# Altium schematic sheet MKXdbV2_DAC0.SchDoc
size A
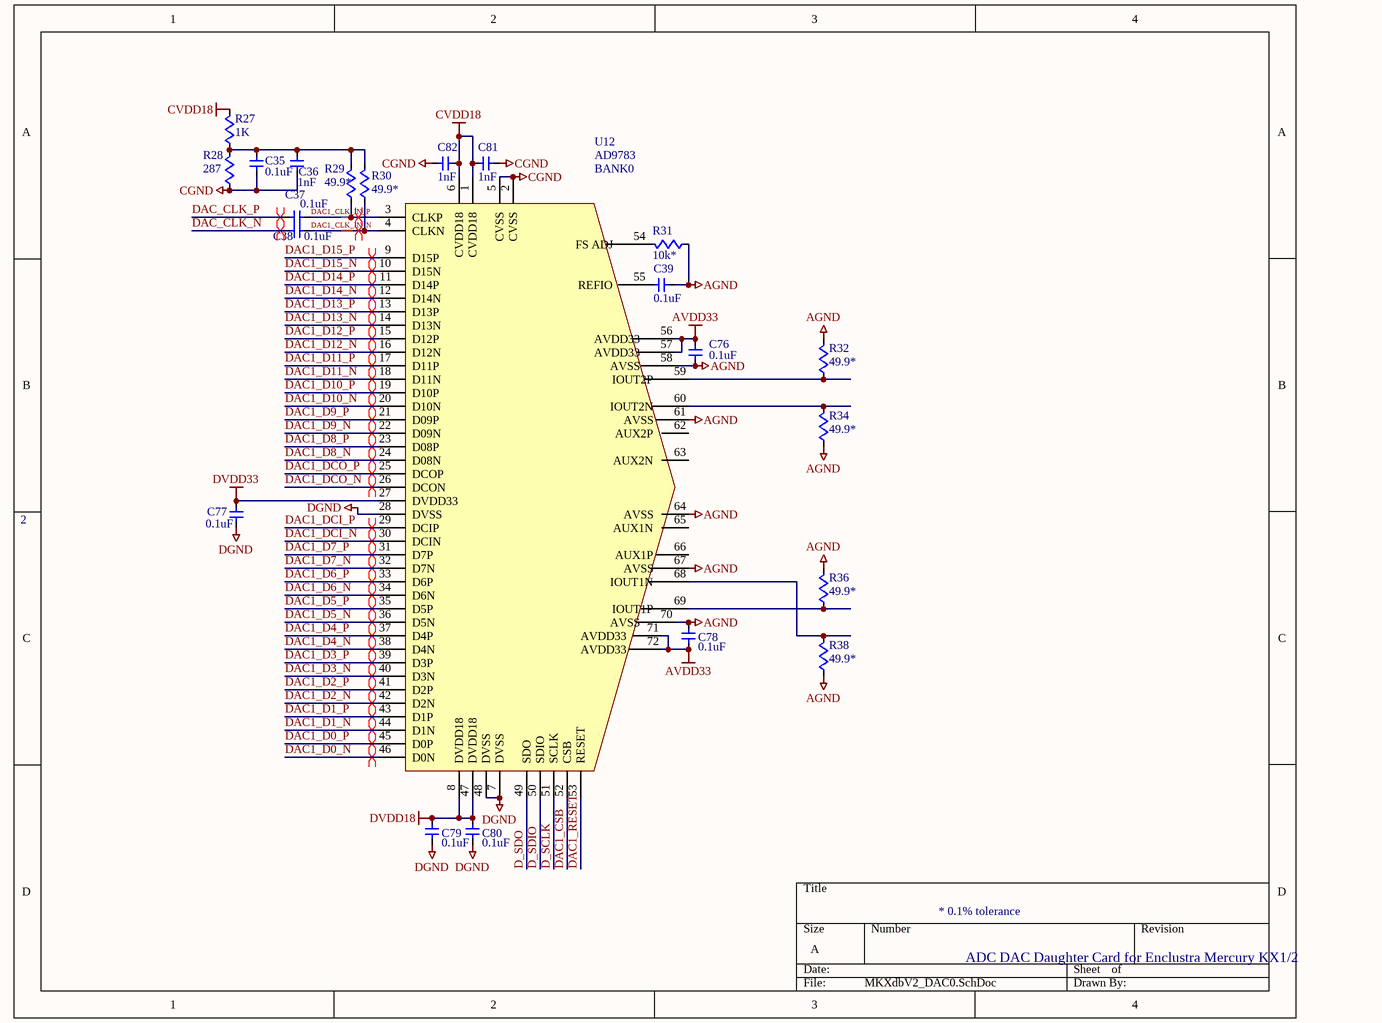
[diagram p0: MKXdbV2_DAC0.SchDoc]

## Parts
C35  0.1uF  [0603w]
C36  1nF  [0603w]
C37  0.1uF  [1206]
C38  0.1uF  [1206]
C39  0.1uF  [0603w]
C76  0.1uF  [0603w]
C77  0.1uF  [0603w]
C78  0.1uF  [0603w]
C79  0.1uF  [0603w]
C80  0.1uF  [0603w]
C81  1nF  [0603w]
C82  1nF  [0603w]
R27  1K  [0603w]
R28  287  [0603w]
R29  49.9*  [0603w]
R30  49.9*  [0603w]
R31  10k*  [0603w]
R32  49.9*  [0603w]
R34  49.9*  [0603w]
R36  49.9*  [0603w]
R38  49.9*  [0603w]
U12  AD9783  [LFCSP72]

## Nets
AGND: C39.2 C76.1 C78.2 R31.1 R32.2 R34.1 R36.2 R38.1 U12.58(AVSS) U12.61(AVSS) U12.64(AVSS) U12.67(AVSS) U12.70(AVSS)
AVDD33: C76.2 C78.1 U12.56(AVDD33) U12.57(AVDD33) U12.71(AVDD33) U12.72(AVDD33)
CGND: C35.2 C36.2 C81.2 C82.2 R28.1 U12.2(CVSS) U12.5(CVSS)
CVDD18: C81.1 C82.1 R27.2 U12.1(CVDD18) U12.6(CVDD18)
DGND: C77.2 C79.1 C80.1 U12.7(DVSS) U12.28(DVSS) U12.48(DVSS)
DVDD18: C79.2 C80.2 U12.8(DVDD18) U12.47(DVDD18)
DVDD33: C77.1 U12.27(DVDD33)
D_SCLK: U12.51(SCLK)
D_SDIO: U12.50(SDIO)
D_SDO: U12.49(SDO)
DAC1_CLK_IN_N: C38.2 R30.1 U12.4(CLKN)
DAC1_CLK_IN_P: C37.2 R29.1 U12.3(CLKP)
DAC1_CSB: U12.52(CSB)
DAC1_D0_N: U12.46(D0N)
DAC1_D0_P: U12.45(D0P)
DAC1_D1_N: U12.44(D1N)
DAC1_D1_P: U12.43(D1P)
DAC1_D2_N: U12.42(D2N)
DAC1_D2_P: U12.41(D2P)
DAC1_D3_N: U12.40(D3N)
DAC1_D3_P: U12.39(D3P)
DAC1_D4_N: U12.38(D4N)
DAC1_D4_P: U12.37(D4P)
DAC1_D5_N: U12.36(D5N)
DAC1_D5_P: U12.35(D5P)
DAC1_D6_N: U12.34(D6N)
DAC1_D6_P: U12.33(D6P)
DAC1_D7_N: U12.32(D7N)
DAC1_D7_P: U12.31(D7P)
DAC1_D8_N: U12.24(D08N)
DAC1_D8_P: U12.23(D08P)
DAC1_D9_N: U12.22(D09N)
DAC1_D9_P: U12.21(D09P)
DAC1_D10_N: U12.20(D10N)
DAC1_D10_P: U12.19(D10P)
DAC1_D11_N: U12.18(D11N)
DAC1_D11_P: U12.17(D11P)
DAC1_D12_N: U12.16(D12N)
DAC1_D12_P: U12.15(D12P)
DAC1_D13_N: U12.14(D13N)
DAC1_D13_P: U12.13(D13P)
DAC1_D14_N: U12.12(D14N)
DAC1_D14_P: U12.11(D14P)
DAC1_D15_N: U12.10(D15N)
DAC1_D15_P: U12.9(D15P)
DAC1_DCI_N: U12.30(DCIN)
DAC1_DCI_P: U12.29(DCIP)
DAC1_DCO_N: U12.26(DCON)
DAC1_DCO_P: U12.25(DCOP)
DAC1_RESET: U12.53(RESET)
DAC_CLK_N: C38.1
DAC_CLK_P: C37.1
NetC35_1: C35.1 C36.1 R27.1 R28.2 R29.2 R30.2
NetC39_1: C39.1 U12.55(REFIO)
NetR31_2: R31.2 U12.54(FS_ADJ)
NetR32_1: R32.1 U12.59(IOUT2P)
NetR34_2: R34.2 U12.60(IOUT2N)
NetR36_1: R36.1 U12.69(IOUT1P)
NetR38_2: R38.2 U12.68(IOUT1N)

Not connected (* = marked no-connect by the designer): U12 62(AUX2P) 63(AUX2N) 65(AUX1N) 66(AUX1P)

## Layout directives
differential pair: DAC1_CLK_IN_N, DAC1_CLK_IN_P, DAC1_D0_N, DAC1_D0_P, DAC1_D1_N, DAC1_D1_P, DAC1_D2_N, DAC1_D2_P, DAC1_D3_N, DAC1_D3_P, DAC1_D4_N, DAC1_D4_P, DAC1_D5_N, DAC1_D5_P, DAC1_D6_N, DAC1_D6_P, DAC1_D7_N, DAC1_D7_P, DAC1_D8_N, DAC1_D8_P, DAC1_D9_N, DAC1_D9_P, DAC1_D10_N, DAC1_D10_P, DAC1_D11_N, DAC1_D11_P, DAC1_D12_N, DAC1_D12_P, DAC1_D13_N, DAC1_D13_P, DAC1_D14_N, DAC1_D14_P, DAC1_D15_N, DAC1_D15_P, DAC1_DCI_N, DAC1_DCI_P, DAC1_DCO_N, DAC1_DCO_P, DAC_CLK_N, DAC_CLK_P

## Notes on the sheet
- (near U12) BANK0
- 2
- * 0.1% tolerance
- ADC DAC Daughter Card for Enclustra Mercury KX1/2

## Library data of the parts
C35 C39 C76-C80 = CAP_SM_1: capacitor; Manufacturer: Kemet; Manufacturer Part Number: C0603C104K3RACTU; Capacitance: 0.1µF; Temperature Coefficient: X7R; Tolerance: ±10%; Voltage - Rated: 25V; Applications: General Purpose; Category: Capacitors; ComponentLink1Description: http://www.kemet.com/datasheets&C0603C104K3RACTU; ComponentLink1URL: http://www.kemet.com/datasheets&C0603C104K3RACTU; Features: -; Lead Spacing: -; Lead Style: -; Mounting Type: Surface Mount, MLCC; Operating Temperature: -55°C ~ 125°C; Package / Case: 0603 (1608 Metric); Packaging: Cut Tape (CT); Pricing 1: 10=0.075, 100=0.027, 250=0.01952, 500=0.0144, 1000=0.00975 (USD); Ratings: -; RoHS: RoHS Compliant; Size / Dimension: 0.063" L x 0.032" W (1.60mm x 0.80mm); Stock 1: 2338960; Supplier 1: Digi-Key; Supplier Part Number 1: 399-1281-1-ND; Thickness: 0.80mm
C36 C81 C82 = CAP_SM_1: capacitor; Manufacturer: Murata Electronics North America; Manufacturer Part Number: GRM188R71H102KA01D; Capacitance: 1000pF; Voltage - Rated: 50V; Tolerance: ±10%; Temperature Coefficient: X7R; Supplier 1: Digi-Key; Supplier Part Number 1: 490-1494-1-ND; RoHS: RoHS Compliant; Category: Capacitors; Stock 1: 512721; Pricing 1: 1=0.07, 10=0.043, 50=0.0204, 100=0.0153, 250=0.01104, 500=0.00816, 1000=0.00553 (USD); Mounting Type: Surface Mount, MLCC; Operating Temperature: -55°C ~ 125°C; Applications: General Purpose; Ratings: -; Package / Case: 0603 (1608 Metric); Size / Dimension: 0.063" L x 0.031" W (1.60mm x 0.80mm); Height: -; Thickness: 0.035" (0.90mm); Lead Spacing: -; Features: -; Packaging: Cut Tape (CT); Lead Style: -; ComponentLink1URL: http://search.murata.co.jp/Ceramy/image/img/PDF/ENG/GRM188R71H102KA01.pdf; ComponentLink1Description: http://search.murata.co.jp/Ceramy/image/img/PDF/ENG/GRM188R71H102KA01.pdf
C37 C38 = CAP_SM_1: capacitor; Manufacturer: Murata Electronics North America; Manufacturer Part Number: GRM31C5C1E104JA01L; Capacitance: 0.1µF; Voltage - Rated: 25V; Tolerance: ±5%; Temperature Coefficient: C0G, NP0; Supplier 1: Digi-Key; Supplier Part Number 1: 490-1767-1-ND; RoHS: RoHS Compliant; Category: Capacitors; Stock 1: 374793; Pricing 1: 1=0.57, 10=0.48, 50=0.3436, 100=0.3007, 250=0.23628, 500=0.2148, 1000=0.17184 (USD); Mounting Type: Surface Mount, MLCC; Operating Temperature: -55°C ~ 125°C; Applications: General Purpose; Ratings: -; Package / Case: 1206 (3216 Metric); Size / Dimension: 0.126" L x 0.063" W (3.20mm x 1.60mm); Height: -; Thickness: 0.071" (1.80mm); Lead Spacing: -; Features: -; Packaging: Cut Tape (CT); Lead Style: -; ComponentLink1URL: http://search.murata.co.jp/Ceramy/image/img/PDF/ENG/GRM31C5C1E104JA01.pdf; ComponentLink1Description: http://search.murata.co.jp/Ceramy/image/img/PDF/ENG/GRM31C5C1E104JA01.pdf
R27 = RES_SM: resistor; Manufacturer: Yageo; Manufacturer Part Number: RC0603FR-071KL; Power (Watts): 0.1W, 1/10W; Temperature Coefficient: ±100ppm/°C; Tolerance: ±1%; Supplier 1: Digi-Key; Supplier Part Number 1: 311-1.00KHRCT-ND; RoHS: RoHS Compliant; Category: Resistors; Stock 1: 4416298; Pricing 1: 10=0.014, 50=0.0104, 100=0.0079, 250=0.00584, 500=0.00432, 1000=0.00288 (USD); Resistance (Ohms): 1K; Composition: Thick Film; Features: -; Size / Dimension: 0.063" L x 0.031" W (1.60mm x 0.80mm); Height: 0.018" (0.45mm); Number of Terminations: 2; Packaging: Cut Tape (CT); Package / Case: 0603 (1608 Metric); ComponentLink1URL: http://www.yageo.com/documents/recent/PYu-RC0603_51_RoHS_L_4.pdf; ComponentLink1Description: http://www.yageo.com/documents/recent/PYu-RC0603_51_RoHS_L_4.pdf
R28 = RES_SM: resistor; Manufacturer: Yageo; Manufacturer Part Number: RC0603FR-07287RL; Power (Watts): 0.1W, 1/10W; Temperature Coefficient: ±100ppm/°C; Tolerance: ±1%; Supplier 1: Digi-Key; Supplier Part Number 1: 311-287HRCT-ND; RoHS: RoHS Compliant; Category: Resistors; Stock 1: 82528; Pricing 1: 10=0.014, 50=0.0104, 100=0.0079, 250=0.00584, 500=0.00432, 1000=0.00288 (USD); Resistance (Ohms): 287; Composition: Thick Film; Features: -; Size / Dimension: 0.063" L x 0.031" W (1.60mm x 0.80mm); Height: 0.018" (0.45mm); Number of Terminations: 2; Packaging: Cut Tape (CT); Package / Case: 0603 (1608 Metric); ComponentLink1URL: http://www.yageo.com/documents/recent/PYu-RC0603_51_RoHS_L_4.pdf; ComponentLink1Description: http://www.yageo.com/documents/recent/PYu-RC0603_51_RoHS_L_4.pdf
R29 R30 R32 R34 R36 R38 = RES_SM: resistor; Manufacturer: Stackpole Electronics Inc; Manufacturer Part Number: RNCS0603BKE49R9; Resistance (Ohms): 49.9; Power (Watts): 0.063W, 1/16W; Temperature Coefficient: ±25ppm/°C; Tolerance: ±0.1%; Supplier 1: Digi-Key; Supplier Part Number 1: RNCS0603BKE49R9CT-ND; RoHS: RoHS Compliant; Category: Resistors; Stock 1: 13782; Pricing 1: 1=0.7, 10=0.475, 50=0.2876, 100=0.2375, 250=0.18752, 500=0.16 (USD); Composition: Thin Film; Features: Anti-Corrosive, Moisture Resistant; Size / Dimension: 0.061" L x 0.031" W (1.55mm x 0.80mm); Height: 0.018" (0.45mm); Number of Terminations: 2; Packaging: Cut Tape (CT); Package / Case: 0603 (1608 Metric); ComponentLink1URL: http://www.seielect.com/Catalog/SEI-rncs.pdf; ComponentLink1Description: http://www.seielect.com/Catalog/SEI-rncs.pdf
R31 = RES_SM: resistor; Manufacturer: Susumu; Manufacturer Part Number: RG1608P-103-B-T5; Resistance (Ohms): 10K; Power (Watts): 0.1W, 1/10W; Temperature Coefficient: ±25ppm/°C; Tolerance: ±0.1%; Supplier 1: Digi-Key; Supplier Part Number 1: RG16P10.0KBCT-ND; RoHS: RoHS Compliant; Category: Resistors; Stock 1: 368390; Pricing 1: 10=0.409, 50=0.2478, 200=0.2047, 1000=0.10342 (USD); Composition: Thin Film; Features: -; Size / Dimension: 0.063" L x 0.031" W (1.60mm x 0.80mm); Height: 0.016" (0.40mm); Number of Terminations: 2; Packaging: Cut Tape (CT); Package / Case: 0603 (1608 Metric); ComponentLink1URL: http://www.susumu-usa.com/pdf/RG_RM_RGH_DATASHEET.pdf; ComponentLink1Description: http://www.susumu-usa.com/pdf/RG_RM_RGH_DATASHEET.pdf
U12 = AD9783: DAC LVDS DUAL16BIT 500MSPS; Supplier 1: Digi-Key; Supplier Part Number 1: AD9783BCPZ-ND